# Altium schematic sheet BG95_Broadband_Modem.SchDoc: BG95 Broadband Modem
size A4; DocumentNumber: 15; SheetNumber: 15; SheetTotal: 50
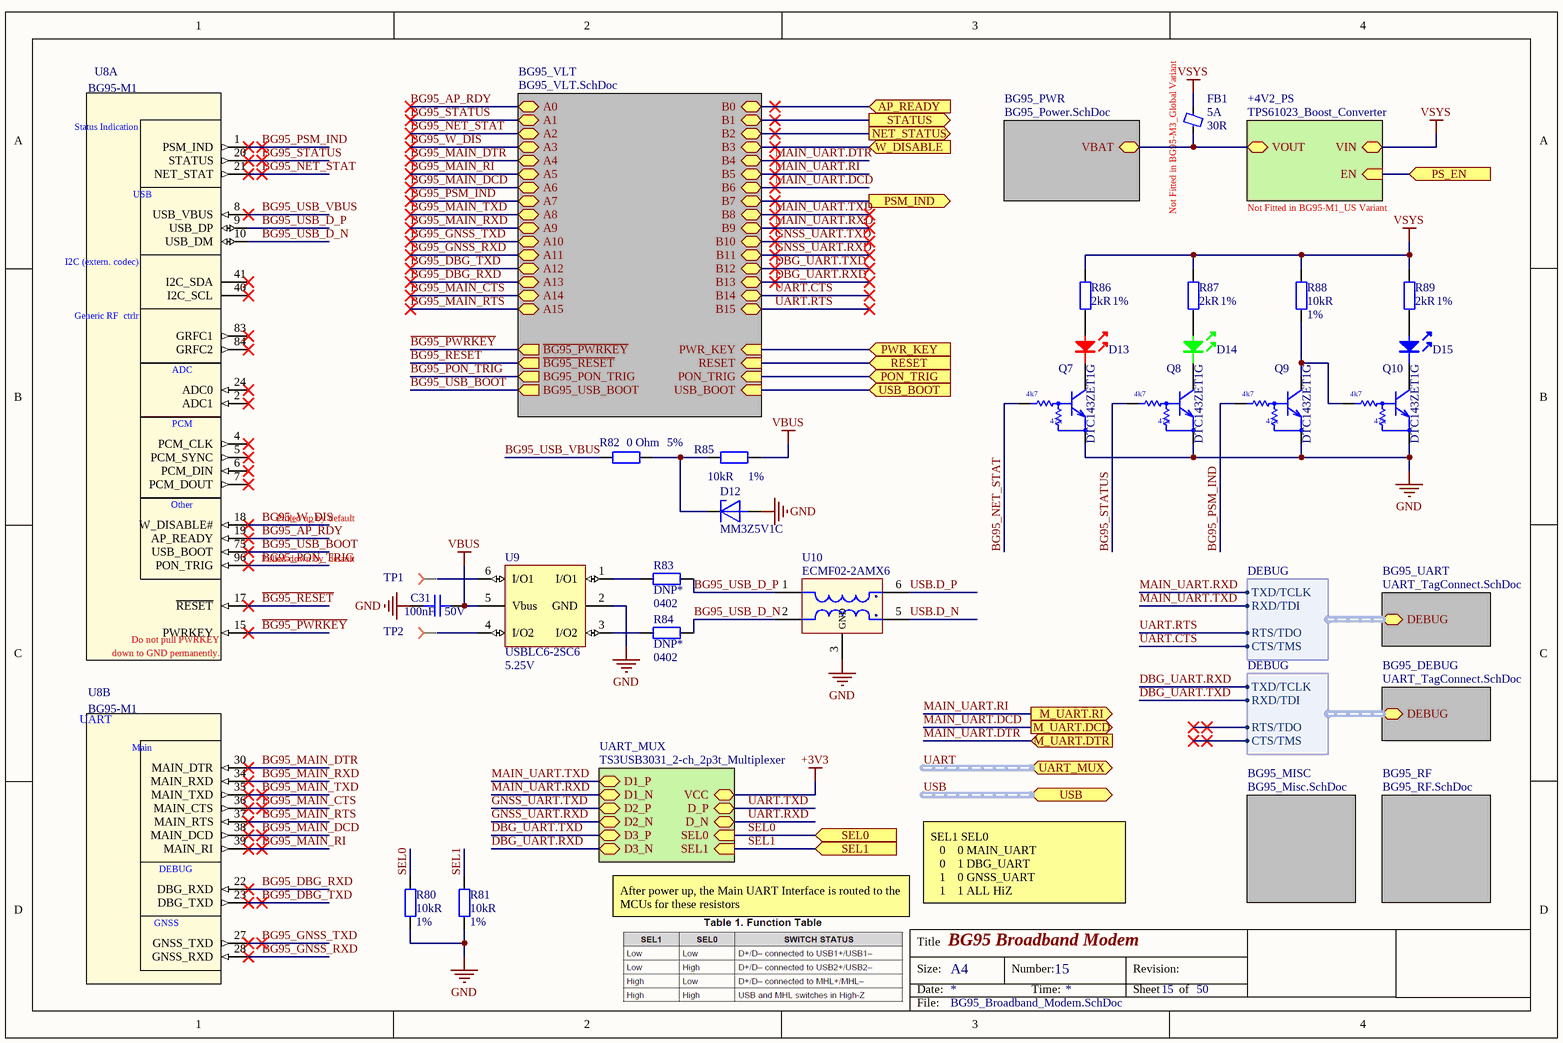
[diagram p0: BG95_Broadband_Modem.SchDoc]

## Parts
C31  Capacitance: 100nF  Voltage: 50V  [C0402]  (hidden comment: CAP CER 0.1UF 50V X7R 0402)
D12  MM3Z5V1C  [SOD-323F]
D13  LED RED CLEAR 0603 SMD  [LED_0603]  (value not drawn)
D14  LED GREEN CLEAR 0603 SMD  [LED_0603]  (value not drawn)
D15  LED BLUE CLEAR 0603 SMD  [LED_0603]  (value not drawn)
FB1  Not Fitted in BG95-M3_Global Variant  Current Rating: 5A  Impedance: 30R  [L0603]
Q7  DTC143ZET1G  [SOT-416FL_ONS]
Q8  DTC143ZET1G  [SOT-416FL_ONS]
Q9  DTC143ZET1G  [SOT-416FL_ONS]
Q10  DTC143ZET1G  [SOT-416FL_ONS]
R80  Resistance: 10kR  Tolerance: 1%  [R0402]  (hidden comment: RES SMD 10K OHM 1% 1/16W 0402)
R81  Resistance: 10kR  Tolerance: 1%  [R0402]  (hidden comment: RES SMD 10K OHM 1% 1/16W 0402)
R82  Tolerance: 5%  Resistance: 0 Ohm  [R0402]  (hidden comment: RES SMD 0 OHM JUMPER 1/16W 0402)
R83  DNP*  Case/Package: 0402  [R0402]  (no BOM)
R84  DNP*  Case/Package: 0402  [R0402]  (no BOM)
R85  Resistance: 10kR  Tolerance: 1%  [R0402]  (hidden comment: RES SMD 10K OHM 1% 1/16W 0402)
R86  Resistance: 2kR  Tolerance: 1%  [R0402]  (hidden comment: RES SMD 2K OHM 1% 1/16W 0402)
R87  Resistance: 2kR  Tolerance: 1%  [R0402]  (hidden comment: RES SMD 2K OHM 1% 1/16W 0402)
R88  Resistance: 10kR  Tolerance: 1%  [R0402]  (hidden comment: RES SMD 10K OHM 1% 1/16W 0402)
R89  Resistance: 2kR  Tolerance: 1%  [R0402]  (hidden comment: RES SMD 2K OHM 1% 1/16W 0402)
TP1  Test Point Pad  [Testpoint]  (value not drawn)  (no BOM)
TP2  Test Point Pad  [Testpoint]  (value not drawn)  (no BOM)
U8  BG95-M1  [BG95]  (parts A,B of 6)
U9  USBLC6-2SC6  Reverse Standoff Voltage: 5.25V  [SOT-23-6]
U10  ECMF02-2AMX6  [QFN-6L]

## Sub-sheets
+4V2_PS = TPS61023_Boost_Converter: VOUT, EN (in), VIN  | Variant: Not Fitted in BG95-M1_US Variant
BG95_DEBUG = UART_TagConnect.SchDoc: DEBUG (harness DEBUG)  | Caption: BG95_DEBUG
BG95_MISC = BG95_Misc.SchDoc: no entries
BG95_PWR = BG95_Power.SchDoc: VBAT
BG95_RF = BG95_RF.SchDoc: no entries
BG95_UART = UART_TagConnect.SchDoc: DEBUG (harness DEBUG)  | Caption: BG95_UART
BG95_VLT = BG95_VLT.SchDoc: B4, B5, B6, B1, A0, A7, B2, B0, A1, B3, A6, A2, A5, A3, A4, B7, PWR_KEY (in), RESET (in), ~{BG95_RESET} (out), ~{BG95_PWRKEY} (out), PON_TRIG (in), BG95_PON_TRIG (out), USB_BOOT (in), BG95_USB_BOOT (out), A10, A11, A12, A13, B8, A14, A15, B9, B12, B13, B14, B10, B11, B15, A8, A9
UART_MUX = TS3USB3031_2-ch_2p3t_Multiplexer: VCC, D_P (bidir), D_N (bidir), D1_N (bidir), D1_P (bidir), D2_P (bidir), D2_N (bidir), D3_N (bidir), D3_P (bidir), SEL0 (in), SEL1 (in)

## Ports
AP_READY (in), M_UART.DCD (out), M_UART.DTR (in), M_UART.RI (out), NET_STATUS (out), PON_TRIG (in), PS_EN (in), PSM_IND (out), PWR_KEY (in), RESET (in), SEL0 (in), SEL1 (in), STATUS (out), UART_MUX (harness UART), USB (harness USB), USB_BOOT (in), W_DISABLE (in)

## Harnesses
DEBUG: TXD/TCLK, RXD/TDI, RTS/TDO, CTS/TMS

## Nets
+3V3: sheet UART_MUX/VCC
GND: C31.2 D12.2(A) Q7.2(E) Q8.2(E) Q9.2(E) Q10.2(E) R80.2 R81.2 U9.2(GND) U10.3(GND)
VBUS: C31.1 R85.1 U9.5(Vbus)
VSYS: FB1.2 R86.2 R87.2 R88.1 R89.2 ; sheet +4V2_PS/VIN
~{BG95_PWRKEY}: U8.15(PWRKEY) ; sheet BG95_VLT/~{BG95_PWRKEY}
~{BG95_RESET}: U8.17(~{RESET}) ; sheet BG95_VLT/~{BG95_RESET}
AP_READY: port AP_READY, sheet BG95_VLT/B0
BG95_AP_RDY: U8.19(AP_READY) ; sheet BG95_VLT/A0
BG95_DBG_RXD: U8.22(DBG_RXD) ; sheet BG95_VLT/A13
BG95_DBG_TXD: U8.23(DBG_TXD) ; sheet BG95_VLT/A12
BG95_GNSS_RXD: U8.28(GNSS_RXD) ; sheet BG95_VLT/A11
BG95_GNSS_TXD: U8.27(GNSS_TXD) ; sheet BG95_VLT/A10
BG95_MAIN_CTS: U8.36(MAIN_CTS) ; sheet BG95_VLT/A14
BG95_MAIN_DCD: U8.38(MAIN_DCD) ; sheet BG95_VLT/A6
BG95_MAIN_DTR: U8.30(MAIN_DTR) ; sheet BG95_VLT/A4
BG95_MAIN_RI: U8.39(MAIN_RI) ; sheet BG95_VLT/A5
BG95_MAIN_RTS: U8.37(MAIN_RTS) ; sheet BG95_VLT/A15
BG95_MAIN_RXD: U8.34(MAIN_RXD) ; sheet BG95_VLT/A9
BG95_MAIN_TXD: U8.35(MAIN_TXD) ; sheet BG95_VLT/A8
BG95_NET_STAT: Q7.1(B) U8.21(NET_STAT) ; sheet BG95_VLT/A2
BG95_PON_TRIG: U8.96(PON_TRIG) ; sheet BG95_VLT/BG95_PON_TRIG
BG95_PSM_IND: Q9.1(B) U8.1(PSM_IND) ; sheet BG95_VLT/A7
BG95_STATUS: Q8.1(B) U8.20(STATUS) ; sheet BG95_VLT/A1
BG95_USB_BOOT: U8.75(USB_BOOT) ; sheet BG95_VLT/BG95_USB_BOOT
BG95_USB_D_N: R84.1 U8.10(USB_DM) U10.2(INP2)
BG95_USB_D_P: R83.1 U8.9(USB_DP) U10.1(INP1)
BG95_USB_VBUS: R82.1 U8.8(USB_VBUS)
BG95_W_DIS: U8.18(W_DISABLE#) ; sheet BG95_VLT/A3
DBG_UART.RXD: sheet BG95_VLT/B13, sheet UART_MUX/D3_N, sheet BG95_DEBUG/DEBUG.TXD/TCLK
DBG_UART.TXD: sheet BG95_VLT/B12, sheet UART_MUX/D3_P, sheet BG95_DEBUG/DEBUG.RXD/TDI
GNSS_UART.RXD: sheet BG95_VLT/B11, sheet UART_MUX/D2_N
GNSS_UART.TXD: sheet BG95_VLT/B10, sheet UART_MUX/D2_P
MAIN_UART.DCD: port M_UART.DCD, sheet BG95_VLT/B6
MAIN_UART.DTR: port M_UART.DTR, sheet BG95_VLT/B4
MAIN_UART.RI: port M_UART.RI, sheet BG95_VLT/B5
MAIN_UART.RXD: sheet BG95_VLT/B9, sheet UART_MUX/D1_N, sheet BG95_UART/DEBUG.TXD/TCLK
MAIN_UART.TXD: sheet BG95_VLT/B8, sheet UART_MUX/D1_P, sheet BG95_UART/DEBUG.RXD/TDI
NET_STATUS: port NET_STATUS, sheet BG95_VLT/B2
PON_TRIG: port PON_TRIG, sheet BG95_VLT/PON_TRIG
PS_EN: port PS_EN, sheet +4V2_PS/EN
PSM_IND: port PSM_IND, sheet BG95_VLT/B7
PWR_KEY: port PWR_KEY, sheet BG95_VLT/PWR_KEY
RESET: port RESET, sheet BG95_VLT/RESET
SEL0: R80.1 ; port SEL0, sheet UART_MUX/SEL0
SEL1: R81.1 ; port SEL1, sheet UART_MUX/SEL1
STATUS: port STATUS, sheet BG95_VLT/B1
UART.CTS: sheet BG95_VLT/B14, sheet BG95_UART/DEBUG.CTS/TMS
UART.RTS: sheet BG95_VLT/B15, sheet BG95_UART/DEBUG.RTS/TDO
UART.RXD: sheet UART_MUX/D_N
UART.TXD: sheet UART_MUX/D_P
USB.D_N: U10.5(OUT2)
USB.D_P: U10.6(OUT1)
USB_BOOT: port USB_BOOT, sheet BG95_VLT/USB_BOOT
W_DISABLE: port W_DISABLE, sheet BG95_VLT/B3
NetD12_1: D12.1(K) R82.2 R85.2
NetD13_1: D13.1(K) Q7.3(C)
NetD13_2: D13.2(A) R86.1
NetD14_1: D14.1(K) Q8.3(C)
NetD14_2: D14.2(A) R87.1
NetD15_1: D15.1(K) Q10.3(C)
NetD15_2: D15.2(A) R89.1
NetFB1_1: FB1.1 ; sheet BG95_PWR/VBAT, sheet +4V2_PS/VOUT
NetQ9_3: Q9.3(C) Q10.1(B) R88.2
NetR83_2: R83.2 U9.1(I/O1)
NetR84_2: R84.2 U9.3(I/O2)
NetTP1_1: TP1.1 U9.6(I/O1)
NetTP2_1: TP2.1 U9.4(I/O2)

Not connected (* = marked no-connect by the designer): U8 2(ADC1)* 4(PCM_CLK)* 5(PCM_SYNC)* 6(PCM_DIN)* 7(PCM_DOUT)* 24(ADC0)* 40(I2C_SCL)* 41(I2C_SDA)* 83(GRFC1)* 84(GRFC2)*; U10 4(NC)

## Buses and harness runs
harness UART = port UART_MUX
harness USB = port USB

## Notes on the sheet
- Pulled up by default
- (near TP1) Pulled-down by  default
- After power up, the Main UART Interface is routed to the MCUs for these resistors
- SEL1	SEL0
  0	   0	MAIN_UART
  0	   1	DBG_UART
  1	   0	GNSS_UART
  1	   1	ALL HiZ
- Title
- Size:
- Date:
- A4
- Number:
- Time:
- Revision:
- Sheet
- of
- File:
- (in symbol MOD BG95 RX TXRX CELLULAR LTE/NAV SMD, part A) Status Indication; USB; I2C (extern. codec); Generic RF  ctrlr; ADC; PCM; Other; Do not pull PWRKEY; down to GND permanently.
- (in symbol MOD BG95 RX TXRX CELLULAR LTE/NAV SMD, part B) UART; Main; DEBUG; GNSS
- (in symbol TRANS PREBIAS NPN 200MW SC75) 4k7; 47k

## Library data of the parts
C31 = CAP CER 0.1UF 50V X7R 0402: 0.1µF ±10% 50V Ceramic Capacitor X7R 0402 (1005 Metric); Manufacturer: TDK; Manufacturer Part Number: CGA2B3X7R1H104K050BB; Supplier 1: Digi-Key; Stock 1: 2925303; Pricing 1: 1=0.17, 10=0.118, 50=0.0668, 100=0.0553, 500=0.0388, 1000=0.0321, 2500=0.0299, 5000=0.0273 (USD); Mount: Surface Mount; Case/Package: 0402; Weight: 2.3E-05oz; Case Code (Metric): 1005; Case Code (Imperial): 0402; Min Operating Temperature: -55°C; Max Operating Temperature: 125°C; Voltage Rating: 50V; Tolerance: 10%; Packaging: Tape and Reel; Package Quantity: 1; Voltage Rating (DC): 50V; Dielectric: X7R; Termination: SMD/SMT; Composition: Ceramic; Length: 1mm; Height: 0.5mm; Width: 0.02inch; Thickness: 0.022inch; Depth: 0.5mm; Ratings: AEC-Q200; REACH SVHC: No SVHC; Lead Free: Lead Free; ComponentLink1URL: http://product.tdk.com/capacitor/mlcc/en/documents/mlccspec_automotive_general_midvoltage_en.pdf?src-supplier=Future+Electronics; ComponentLink1Description: http://product.tdk.com/capacitor/mlcc/en/documents/mlccspec_automotive_general_midvoltage_en.pdf?src-supplier=Future+Electronics; ComponentLink2URL: http://www.farnell.com/datasheets/1807242.pdf?src-supplier=Element14; ComponentLink2Description: http://www.farnell.com/datasheets/1807242.pdf?src-supplier=Element14; ComponentLink3URL: http://www.mouser.com/ds/2/400/lcc_automotive_general_en-843974.pdf?src-supplier=Mouser; ComponentLink3Description: http://www.mouser.com/ds/2/400/lcc_automotive_general_en-843974.pdf?src-supplier=Mouser; ComponentLink4URL: http://www.farnell.com/datasheets/1936565.pdf?src-supplier=Element14; ComponentLink4Description: http://www.farnell.com/datasheets/1936565.pdf?src-supplier=Element14; ComponentLink5URL: http://www.farnell.com/datasheets/1735392.pdf?src-supplier=Element14; ComponentLink5Description: http://www.farnell.com/datasheets/1735392.pdf?src-supplier=Element14; Supplier Part Number 1: 445-6899-1-ND
D12 = DIODE ZENER 5.1V 200MW SOD323F: Zener Diode 5.1V 200mW ±5% Surface Mount SOD-323F; Manufacturer: ON Semiconductor / Fairchild; Impedance: 56R; Max Reverse Leakage Current: 1.8uA; Test Current: 5mA; Element Configuration: Single; Supplier 1: Digi-Key; Manufacturer Part Number: MM3Z5V1C; Stock 1: 27359; Pricing 1: 1=0.2, 10=0.167, 25=0.1396, 100=0.0682, 500=0.0569, 1000=0.0395 (USD); Mount: Surface Mount; Number of Pins: 2; Weight: 0.0276g; Min Operating Temperature: -65°C; Max Operating Temperature: 150°C; Packaging: Tape and Reel; Package Quantity: 1; Tolerance: 5%; Max Power Dissipation: 200mW; Zener Voltage: 5.1V; Voltage Tolerance: 5%; Power Dissipation: 200mW; Length: 1.3mm; Height: 1mm; Width: 1.7mm; Radiation Hardening: No; REACH SVHC: No SVHC; Lead Free: Lead Free; ComponentLink1URL: http://www.fairchildsemi.com/datasheets/MM/MM3Z10VC.pdf?src-supplier=Digi-Key; ComponentLink1Description: http://www.fairchildsemi.com/datasheets/MM/MM3Z10VC.pdf?src-supplier=Digi-Key; ComponentLink2URL: http://www.onsemi.com/pub/Collateral/MM3Z9V1C-D.pdf?src-supplier=Digi-Key; ComponentLink2Description: http://www.onsemi.com/pub/Collateral/MM3Z9V1C-D.pdf?src-supplier=Digi-Key; ComponentLink3URL: http://www.mouser.com/ds/2/149/MM3Z5V1C-195780.pdf?src-supplier=Mouser; ComponentLink3Description: http://www.mouser.com/ds/2/149/MM3Z5V1C-195780.pdf?src-supplier=Mouser; ComponentLink4URL: http://www.fairchildsemi.com/ds/MM/MM3Z9V1C.pdf?src-supplier=Avnet; ComponentLink4Description: http://www.fairchildsemi.com/ds/MM/MM3Z9V1C.pdf?src-supplier=Avnet; Supplier Part Number 1: MM3Z5V1CCT-ND
D13 = LED RED CLEAR 0603 SMD: Red 631nm LED Indication - Discrete 2V 0603 (1608 Metric); Manufacturer: Vishay Lite-On; Manufacturer Part Number: LTST-C191KRKT; Lens Color: Colorless; Power Rating: 75mW; Luminous Intensity: 54mcd; Viewing Angle: 130°; Lens Style: Clear,Diffused,Colorless,Rectangular; Forward Current: 30mA; Test Current: 20mA; Number of Elements: 1; Wavelength: 639nm; Reverse Voltage: 5V; Supplier 1: Digi-Key; Stock 1: 230321; Pricing 1: 1=0.26, 10=0.192, 100=0.0909, 500=0.0606, 1000=0.0475, 2500=0.0465 (USD); Mount: Surface Mount; Case/Package: 0603; Number of Pins: 2; Color: Red; Case Code (Metric): 1608; Case Code (Imperial): 0603; Min Operating Temperature: -55°C; Max Operating Temperature: 85°C; Packaging: Tape and Reel; Forward Voltage: 2V; Package Quantity: 1; Illumination Color: Red; Dominant Wavelength: 631nm; Lens Transparency: Clear; Power Dissipation: 75mW; Number of LEDs: 1; Voltage: 2V; Length: 1.6mm; Height: 0.55mm; Width: 0.8mm; Depth: 0.8mm; Radiation Hardening: No; Lead Free: Lead Free; ComponentLink1URL: http://optoelectronics.liteon.com/upload/download/DS22-2000-223/LTST-C191KRKT.PDF?src-supplier=Digi-Key; ComponentLink1Description: http://optoelectronics.liteon.com/upload/download/DS22-2000-223/LTST-C191KRKT.PDF?src-supplier=Digi-Key; ComponentLink2URL: http://www1.futureelectronics.com/doc/LITE-ON/LTST-C191KRKT.pdf?src-supplier=Future+Electronics; ComponentLink2Description: http://www1.futureelectronics.com/doc/LITE-ON/LTST-C191KRKT.pdf?src-supplier=Future+Electronics; ComponentLink3URL: https://www.verical.com/server-webapp/html/getDatasheet?partID=141922&src-supplier=Verical; ComponentLink3Description: https://www.verical.com/server-webapp/html/getDatasheet?partID=141922&src-supplier=Verical; ComponentLink4URL: http://www.mouser.com/ds/2/239/LTST-C191KRKT-1140668.pdf?src-supplier=Mouser; ComponentLink4Description: http://www.mouser.com/ds/2/239/LTST-C191KRKT-1140668.pdf?src-supplier=Mouser; Supplier Part Number 1: 160-1447-1-ND
D14 = LED GREEN CLEAR 0603 SMD: Green 571nm LED Indication - Discrete 2V 0603 (1608 Metric); Manufacturer: Vishay Lite-On; Manufacturer Part Number: LTST-C191KGKT; Lens Color: Colorless; Luminous Intensity: 35mcd; Viewing Angle: 130°; Test Current: 20mA; Wavelength: 574nm; Lens Style: Rectangular,Colorless; Forward Current: 30mA; Number of Elements: 1; Power Dissipation: 75mW; Reverse Voltage: 5V; Supplier 1: Digi-Key; Supplier Part Number 1: 160-1446-6-ND; Stock 1: 788359; Pricing 1: 1=0.28, 10=0.201, 100=0.0954, 500=0.0636, 1000=0.0498, 2500=0.0488 (USD); Mount: Surface Mount; Number of Pins: 2; Case Code (Metric): 1608; Case Code (Imperial): 0603; Min Operating Temperature: -55°C; Max Operating Temperature: 85°C; Packaging: Tape and Reel; Package Quantity: 1; Forward Voltage: 2V; Dominant Wavelength: 571nm; Lens Transparency: Clear; Illumination Color: Green; Number of LEDs: 1; Power Rating: 75mW; Max Power Dissipation: 75mW; Length: 1.6mm; Height: 0.55mm; Width: 0.8mm; Depth: 0.8mm; Radiation Hardening: No; Lead Free: Lead Free; ComponentLink1URL: http://optoelectronics.liteon.com/upload/download/DS22-2000-228/LTST-C191KGKT.PDF?src-supplier=Digi-Key; ComponentLink1Description: http://optoelectronics.liteon.com/upload/download/DS22-2000-228/LTST-C191KGKT.PDF?src-supplier=Digi-Key
D15 = LED BLUE CLEAR 0603 SMD: Blue 470nm LED Indication - Discrete 3.3V 0603 (1608 Metric); Manufacturer: Vishay Lite-On; Manufacturer Part Number: LTST-C191TBKT; Lens Color: Colorless; Luminous Intensity: 180mcd; Viewing Angle: 130°; Forward Voltage: 3.8V; Dominant Wavelength: 475nm; Test Current: 20mA; Wavelength: 468nm; Lens Style: Diffused,Colorless,Clear,Rectangular; Number of Elements: 1; Power Dissipation: 76mW; Reverse Voltage: 5V; Max Power Dissipation: 75mW; Supplier 1: Digi-Key; Supplier Part Number 1: 160-1647-1-ND; Stock 1: 239244; Pricing 1: 1=0.48, 10=0.342, 100=0.152, 500=0.1064, 1000=0.0874, 2500=0.076 (USD); Mount: Surface Mount; Number of Pins: 2; Case Code (Metric): 1608; Case Code (Imperial): 0603; Min Operating Temperature: -20°C; Max Operating Temperature: 80°C; Packaging: Tape and Reel; Package Quantity: 1; Lens Transparency: Clear; Forward Current: 20mA; Illumination Color: Blue; Number of LEDs: 1; Length: 0.8mm; Height: 0.55mm; Width: 0.8mm; Depth: 1.6mm; Radiation Hardening: No; Lead Free: Lead Free; ComponentLink1URL: http://optoelectronics.liteon.com/upload/download/DS22-2000-230/LTST-C191TBKT.pdf?src-supplier=Digi-Key; ComponentLink1Description: http://optoelectronics.liteon.com/upload/download/DS22-2000-230/LTST-C191TBKT.pdf?src-supplier=Digi-Key; Case/Package: 0603; Color: Blue; ComponentLink2URL: http://optoelectronics.liteon.com/upload/download/DS22-2000-230/LTST-C191TBKT.pdf?src-supplier=Verical; ComponentLink2Description: http://optoelectronics.liteon.com/upload/download/DS22-2000-230/LTST-C191TBKT.pdf?src-supplier=Verical; ComponentLink3URL: http://optoelectronics.liteon.com/upload/download/DS22-2000-230/LTST-C191TBKT.pdf?src-supplier=Mouser; ComponentLink3Description: http://optoelectronics.liteon.com/upload/download/DS22-2000-230/LTST-C191TBKT.pdf?src-supplier=Mouser; ComponentLink4URL: http://www1.futureelectronics.com/doc/LITE-ON/LTST-C191TBKT.pdf?src-supplier=Future+Electronics; ComponentLink4Description: http://www1.futureelectronics.com/doc/LITE-ON/LTST-C191TBKT.pdf?src-supplier=Future+Electronics; ComponentLink5URL: http://optoelectronics.liteon.com/upload/download/DS22-2000-230/LTST-C191TBKT.pdf?src-supplier=Jameco; ComponentLink5Description: http://optoelectronics.liteon.com/upload/download/DS22-2000-230/LTST-C191TBKT.pdf?src-supplier=Jameco; ComponentLink6URL: http://uk.rs-online.com/webdocs/0dc0/0900766b80dc02b4.pdf?src-supplier=RSComponents; ComponentLink6Description: http://uk.rs-online.com/webdocs/0dc0/0900766b80dc02b4.pdf?src-supplier=RSComponents; ComponentLink7URL: http://datasheet.iiic.cc/lite-on/LTST-C191TBKT.pdf?src-supplier=IIIC; ComponentLink7Description: http://datasheet.iiic.cc/lite-on/LTST-C191TBKT.pdf?src-supplier=IIIC
FB1 = FERRITE BEAD 30 OHM 0603 1LN: 30 Ohms @ 100MHz 1 Power Line Ferrite Bead 0603 (1608 Metric) 5A 10mOhm; Manufacturer: TDK; Manufacturer Part Number: MPZ1608S300ATAH0; Tolerance: 25%; DC Resistance (DCR): 10mR; Supplier 1: Digi-Key; Stock 1: 93167; Pricing 1: 1=0.1, 10=0.079, 25=0.0716, 50=0.0644, 100=0.0472, 250=0.0343, 500=0.0315, 1000=0.0272 (USD); Case/Package: 0603; Case Code (Metric): 1608; Case Code (Imperial): 0603; Min Operating Temperature: -55°C; Max Operating Temperature: 125°C; Package Quantity: 4000; Packaging: Tape and Reel; Termination: SMD/SMT; Length: 0.063inch; Height: 0.6mm; Width: 0.031inch; Depth: 0.8mm; REACH SVHC: No SVHC; Lead Free: Lead Free; ComponentLink1URL: https://media.digikey.com/pdf/Data%20Sheets/TDK%20PDFs/MPZ_Series_Br.pdf?src-supplier=Digi-Key; ComponentLink1Description: https://media.digikey.com/pdf/Data%20Sheets/TDK%20PDFs/MPZ_Series_Br.pdf?src-supplier=Digi-Key; ComponentLink2URL: http://www.farnell.com/datasheets/1795297.pdf?src-supplier=Element14; ComponentLink2Description: http://www.farnell.com/datasheets/1795297.pdf?src-supplier=Element14; Supplier Part Number 1: 445-1562-6-ND; Max DC Current: 5A; Test Frequency: 100MHz; Revision: July-2002: Re-released for DXP Platform.; Mount: Surface Mount; Weight: 7.1E-05oz; Core Material: Ferrite
Q7-Q10 = TRANS PREBIAS NPN 200MW SC75: Pre-Biased Bipolar Transistor (BJT) NPN - Pre-Biased 50V 100mA  200mW Surface Mount SC-75, SOT-416; Manufacturer: ON Semiconductor; Element Configuration: Single; hFE Min: 80; Collector Emitter Saturation Voltage: 250mV; Emitter Base Voltage (VEBO): 6V; Supplier 1: Digi-Key; Manufacturer Part Number: DTC143ZET1G; Stock 1: 44167; Pricing 1: 1=0.14, 10=0.129, 25=0.1224, 100=0.0539, 500=0.0423, 1000=0.0294 (USD); Case/Package: SC; Number of Pins: 3; Contact Plating: Tin,Matte; Min Operating Temperature: -55°C; Max Operating Temperature: 150°C; Package Quantity: 1; Collector Emitter Voltage (VCEO): 50V; Packaging: Tape and Reel; Max Collector Current: 100mA; Max Power Dissipation: 200mW; Collector Emitter Breakdown Voltage: 50V; Max Output Current: 100mA; Operating Supply Voltage: 50V; Max Breakdown Voltage: 50V; Polarity: NPN; Continuous Collector Current: 100mA; Power Dissipation: 200mW; Voltage Rating (DC): 50V; Current Rating: 100mA; Length: 1.65mm; Height: 0.8mm; Width: 0.9mm; Radiation Hardening: No; Lead Free: Lead Free; REACH SVHC: No SVHC; Halogen Free: Halogen Free; ComponentLink1URL: http://www.onsemi.com/pub/Collateral/DTC143Z-D.PDF?src-supplier=Digi-Key; ComponentLink1Description: http://www.onsemi.com/pub/Collateral/DTC143Z-D.PDF?src-supplier=Digi-Key; ComponentLink2URL: http://www.onsemi.com/pub_link/Collateral/DTC124E-D.PDF?src-supplier=Avnet+Europe; ComponentLink2Description: http://www.onsemi.com/pub_link/Collateral/DTC124E-D.PDF?src-supplier=Avnet+Europe; ComponentLink3URL: https://www.verical.com/server-webapp/html/getDatasheet?partID=60141&src-supplier=Verical; ComponentLink3Description: https://www.verical.com/server-webapp/html/getDatasheet?partID=60141&src-supplier=Verical; Supplier Part Number 1: DTC143ZET1GOSCT-ND; Mount: Surface Mount
R80 R81 R85 R88 = RES SMD 10K OHM 1% 1/16W 0402: 10 kOhms ±1% 0.063W, 1/16W Chip Resistor 0402 (1005 Metric) Moisture Resistant Thick Film; Manufacturer: Yageo; Manufacturer Part Number: RC0402FR-0710KP; Max Power Dissipation: 63mW; Temperature Coefficient: 150ppm/°C; Supplier 1: Digi-Key; Stock 1: 839368; Pricing 1: 1=0.1, 10=0.035, 100=0.014, 1000=0.0063, 2500=0.0055, 5000=0.0045 (USD); Case/Package: 0402; Case Code (Metric): 1005; Case Code (Imperial): 0402; Min Operating Temperature: -55°C; Max Operating Temperature: 155°C; Packaging: Tape and Reel; Composition: Thick Film; Number of Terminations: 2; Features: Moisture Resistant; Length: 0.039inch; Height: 0.016inch; Width: 0.02inch; ComponentLink1URL: http://www.yageo.com/NewPortal/yageodocoutput?fileName=/pdf/R-Chip/PYu-RC_51_RoHS_P_0.pdf&src-supplier=Digi-Key; ComponentLink1Description: http://www.yageo.com/NewPortal/yageodocoutput?fileName=/pdf/R-Chip/PYu-RC_51_RoHS_P_0.pdf&src-supplier=Digi-Key; Supplier Part Number 1: YAG1249CT-ND; Mount: Surface Mount
  R80 R81: ClassName: UART_MUX
R82 = RES SMD 0 OHM JUMPER 1/16W 0402: 0 Ohms Jumper 0.063W, 1/16W Chip Resistor 0402 (1005 Metric) Moisture Resistant Thick Film; Manufacturer: Yageo; Manufacturer Part Number: RC0402JR-070RL; Power Rating: 62.5mW; Voltage Rating: 50V; Max Power Dissipation: 63mW; Temperature Coefficient: 200ppm/°C; Supplier 1: Digi-Key; Stock 1: 46057148; Pricing 1: 1=0.1, 10=0.013, 25=0.0092, 50=0.0072, 100=0.0053, 250=0.004, 500=0.0032, 1000=0.0024, 5000=0.0017 (USD); Contact Plating: Tin,Matte; Case Code (Metric): 1005; Case Code (Imperial): 0402; Min Operating Temperature: -55°C; Max Operating Temperature: 155°C; Packaging: Tape and Reel; Composition: Thick Film; Package Quantity: 1; Number of Terminations: 2; Termination: SMD/SMT; Military Standard: Not; Features: Moisture Resistant; Length: 1mm; Height: 0.016inch; Width: 0.02inch; Depth: 0.5mm; Radiation Hardening: No; REACH SVHC: Unknown; Lead Free: Lead Free; ComponentLink1URL: http://www.yageo.com/documents/recent/PYu-RC_Group_51_RoHS_L_10.pdf?src-supplier=Digi-Key; ComponentLink1Description: http://www.yageo.com/documents/recent/PYu-RC_Group_51_RoHS_L_10.pdf?src-supplier=Digi-Key; ComponentLink2URL: http://www.yageo.com/documents/recent/PYu-RC0402_51_RoHS_L_6.pdf?src-supplier=Avnet+Europe; ComponentLink2Description: http://www.yageo.com/documents/recent/PYu-RC0402_51_RoHS_L_6.pdf?src-supplier=Avnet+Europe; ComponentLink3URL: http://www.farnell.com/datasheets/1018594.pdf?src-supplier=Element14; ComponentLink3Description: http://www.farnell.com/datasheets/1018594.pdf?src-supplier=Element14; ComponentLink4URL: https://www.verical.com/server-webapp/html/getDatasheet?partID=326379&src-supplier=Verical; ComponentLink4Description: https://www.verical.com/server-webapp/html/getDatasheet?partID=326379&src-supplier=Verical; ComponentLink5URL: http://www.farnell.com/datasheets/2167052.pdf?src-supplier=Element14; ComponentLink5Description: http://www.farnell.com/datasheets/2167052.pdf?src-supplier=Element14; Supplier Part Number 1: 311-0.0JRCT-ND; Case/Package: 0402; Mount: Surface Mount
R83 R84 = RES SMD NO BOM 0402: Placeholder for a 0402 resistor
R86 R87 R89 = RES SMD 2K OHM 1% 1/16W 0402: 2 kOhms ±1% 0.063W, 1/16W Chip Resistor 0402 (1005 Metric) Moisture Resistant Thick Film; Manufacturer: Yageo; Manufacturer Part Number: RC0402FR-072KL; Max Power Dissipation: 63mW; Temperature Coefficient: 100ppm/°C; Voltage Rating: 50V; Supplier 1: Digi-Key; Stock 1: 2553156; Pricing 1: 1=0.1, 10=0.016, 100=0.0064, 1000=0.0029, 2500=0.0025, 5000=0.0021 (USD); Case/Package: 0402; Case Code (Metric): 1005; Case Code (Imperial): 0402; Min Operating Temperature: -55°C; Max Operating Temperature: 155°C; Packaging: Tape and Reel; Composition: Thick Film; Number of Terminations: 2; Features: Moisture Resistant; Length: 1mm; Height: 0.016inch; Width: 0.02inch; ComponentLink1URL: http://www.yageo.com/documents/recent/PYu-RC_Group_51_RoHS_L_10.pdf?src-supplier=Digi-Key; ComponentLink1Description: http://www.yageo.com/documents/recent/PYu-RC_Group_51_RoHS_L_10.pdf?src-supplier=Digi-Key; Supplier Part Number 1: 311-2KLRCT-ND; Package Quantity: 1; Power Rating: 63mW; Termination: SMD/SMT; Military Standard: Not; Voltage Rating (DC): 50V; Working Voltage: 50V; Depth: 0.5mm; REACH SVHC: Unknown; Lead Free: Lead Free; ComponentLink2URL: http://documents.rs-components.com/techlib://itc_doclist_GB.htm?stockno=6186510&src-supplier=RSComponents; ComponentLink2Description: http://documents.rs-components.com/techlib://itc_doclist_GB.htm?stockno=6186510&src-supplier=RSComponents; ComponentLink3URL: https://www.verical.com/server-webapp/html/getDatasheet?partID=358921&src-supplier=Verical; ComponentLink3Description: https://www.verical.com/server-webapp/html/getDatasheet?partID=358921&src-supplier=Verical; ComponentLink4URL: http://www.mouser.com/ds/2/447/PYu-RC0402_51_RoHS_L_6_r-8721.pdf?src-supplier=Mouser; ComponentLink4Description: http://www.mouser.com/ds/2/447/PYu-RC0402_51_RoHS_L_6_r-8721.pdf?src-supplier=Mouser; ComponentLink5URL: http://www.farnell.com/datasheets/1018594.pdf?src-supplier=Element14; ComponentLink5Description: http://www.farnell.com/datasheets/1018594.pdf?src-supplier=Element14; ComponentLink6URL: http://www.farnell.com/datasheets/2167052.pdf?src-supplier=Element14; ComponentLink6Description: http://www.farnell.com/datasheets/2167052.pdf?src-supplier=Element14; Mount: Surface Mount
TP1 TP2 = Test Point Pad: Test Point. There is nothing to buy or mount.; ClassName: TestPoint; CompType: TestPoint; Manufacturer: N/A; MountType: N/A; PackageReference: TetsPoint; PartNumber: N/A
U8 = MOD BG95 RX TXRX CELLULAR LTE/NAV SMD: LTE Cat M1, LTE Cat NB2 and EGPRS Transceiver Module Antenna Not Included Surface Mount; Manufacturer: QUECTEL; Part Description: IC MODULE BG95 102-LGA 19.9x23.6mm H2.2mm RO; Geometry.Height: 2.2mm; Value: BG95; Manufacturer Part Number: BG95-M1; PCB DECAL: BG95; Mount: Surface Mount
U9 = TVS DIODE 5.25V 17V SOT23-6: 17V Clamp 5A (8/20µs) Ipp Tvs Diode Surface Mount SOT-23-6; Manufacturer: STMicroelectronics; Data Rate: 480Mbps; Direction: Unidirectional,Bidirectional; Capacitance: 3.5pF; Operating Supply Voltage: 1.1V; Number of Elements: 1; Number of Channels: 2; Reverse Breakdown Voltage: 6V; Working Voltage: 5V; Power Line Protection: Yes; Test Current: 1mA; Max Reverse Leakage Current: 150nA; Element Configuration: Dual; Supplier 1: Digi-Key; Manufacturer Part Number: USBLC6-2SC6; Stock 1: 49245; Pricing 1: 1=0.47, 10=0.399, 25=0.3728, 100=0.2769, 250=0.263, 500=0.2162, 1000=0.1757 (USD); Mount: Surface Mount; Case/Package: SOT-23; Number of Pins: 6; Contact Plating: Tin,Matte; Min Operating Temperature: -40°C; Max Operating Temperature: 125°C; Packaging: Tape and Reel; Package Quantity: 3000; Polarity: Unidirectional,Bidirectional; Breakdown Voltage: 6V; Clamping Voltage: 17V; Termination: SMD/SMT; Number of Bidirectional Channels: 2; Min Breakdown Voltage: 6V; ESD Protection: Yes; Max Breakdown Voltage: 6V; Leakage Current: 150nA; Peak Pulse Current: 5A; Length: 3.05mm; Height: 1.3mm; Width: 1.75mm; Depth: 1.75mm; Radiation Hardening: No; REACH SVHC: No SVHC; Lead Free: Lead Free; ComponentLink1URL: http://www.farnell.com/datasheets/1738051.pdf?src-supplier=Element14; ComponentLink1Description: http://www.farnell.com/datasheets/1738051.pdf?src-supplier=Element14; ComponentLink2URL: http://www.st.com/content/ccc/resource/technical/document/datasheet/06/1d/48/9c/6c/20/4a/b2/CD00050750.pdf/files/CD00050750.pdf/jcr:content/translations/en.CD00050750.pdf?src-supplier=Mouser; ComponentLink2Description: http://www.st.com/content/ccc/resource/technical/document/datasheet/06/1d/48/9c/6c/20/4a/b2/CD00050750.pdf/files/CD00050750.pdf/jcr:content/translations/en.CD00050750.pdf?src-supplier=Mouser; ComponentLink3URL: http://www.st.com/web/en/resource/technical/document/datasheet/CD00050750.pdf?src-supplier=Future+Electronics; ComponentLink3Description: http://www.st.com/web/en/resource/technical/document/datasheet/CD00050750.pdf?src-supplier=Future+Electronics; ComponentLink4URL: http://www.st.com/content/ccc/resource/technical/document/datasheet/06/1d/48/9c/6c/20/4a/b2/CD00050750.pdf/files/CD00050750.pdf/jcr:content/translations/en.CD00050750.pdf?src-supplier=Verical; ComponentLink4Description: http://www.st.com/content/ccc/resource/technical/document/datasheet/06/1d/48/9c/6c/20/4a/b2/CD00050750.pdf/files/CD00050750.pdf/jcr:content/translations/en.CD00050750.pdf?src-supplier=Verical; ComponentLink5URL: http://datasheet.iiic.cc/stmicroelectronics/USBLC6-2SC6.pdf?src-supplier=IIIC; ComponentLink5Description: http://datasheet.iiic.cc/stmicroelectronics/USBLC6-2SC6.pdf?src-supplier=IIIC; ComponentLink6URL: http://www.produktinfo.conrad.com/datenblaetter/1100000-1199999/001184109-da-01-en-IC_ESD_PROTECTI_USBLC6_2SC6_SOT_23_6_STM.pdf?src-supplier=Conrad; ComponentLink6Description: http://www.produktinfo.conrad.com/datenblaetter/1100000-1199999/001184109-da-01-en-IC_ESD_PROTECTI_USBLC6_2SC6_SOT_23_6_STM.pdf?src-supplier=Conrad; Supplier Part Number 1: 497-5235-1-ND
U10 = CMC 200MA 2LN SMD ESD: 2 Line Common Mode Choke Surface Mount  200mA DCR 2.5Ohm; Manufacturer: STMicroelectronics; Number of Lines: 2; DC Resistance (DCR): 2.5R; Supplier 1: Digi-Key; Manufacturer Part Number: ECMF02-2AMX6; Stock 1: 23653; Pricing 1: 1=0.48, 10=0.418, 25=0.3888, 50=0.3288, 100=0.2989, 250=0.281, 500=0.2511, 1000=0.2033 (USD); Mount: Surface Mount; Case/Package: QFN; Number of Pins: 6; Min Operating Temperature: -40°C; Max Operating Temperature: 85°C; Packaging: Tape and Reel; Package Quantity: 1; Current: 200mA; Termination: Flat; Max Current Rating: 200mA; Current Rating: 200mA; Length: 1.75mm; Height: 0.022inch; Width: 0.059inch; Depth: 1.55mm; Radiation Hardening: No; Lead Free: Lead Free; REACH SVHC: No SVHC; ComponentLink1URL: http://www.st.com/web/en/resource/technical/document/datasheet/CD00282307.pdf?src-supplier=Future+Electronics; ComponentLink1Description: http://www.st.com/web/en/resource/technical/document/datasheet/CD00282307.pdf?src-supplier=Future+Electronics; ComponentLink2URL: http://www.st.com/content/ccc/resource/technical/document/datasheet/3a/28/cf/d0/31/63/48/8c/CD00282307.pdf/files/CD00282307.pdf/jcr:content/translations/en.CD00282307.pdf?src-supplier=Digi-Key; ComponentLink2Description: http://www.st.com/content/ccc/resource/technical/document/datasheet/3a/28/cf/d0/31/63/48/8c/CD00282307.pdf/files/CD00282307.pdf/jcr:content/translations/en.CD00282307.pdf?src-supplier=Digi-Key; ComponentLink3URL: http://www.mouser.com/ds/2/389/ecmf02-2amx6-954491.pdf?src-supplier=Mouser; ComponentLink3Description: http://www.mouser.com/ds/2/389/ecmf02-2amx6-954491.pdf?src-supplier=Mouser; ComponentLink4URL: https://www.verical.com/server-webapp/html/getDatasheet?partID=259862&src-supplier=Verical; ComponentLink4Description: https://www.verical.com/server-webapp/html/getDatasheet?partID=259862&src-supplier=Verical; Supplier Part Number 1: 497-10773-1-ND